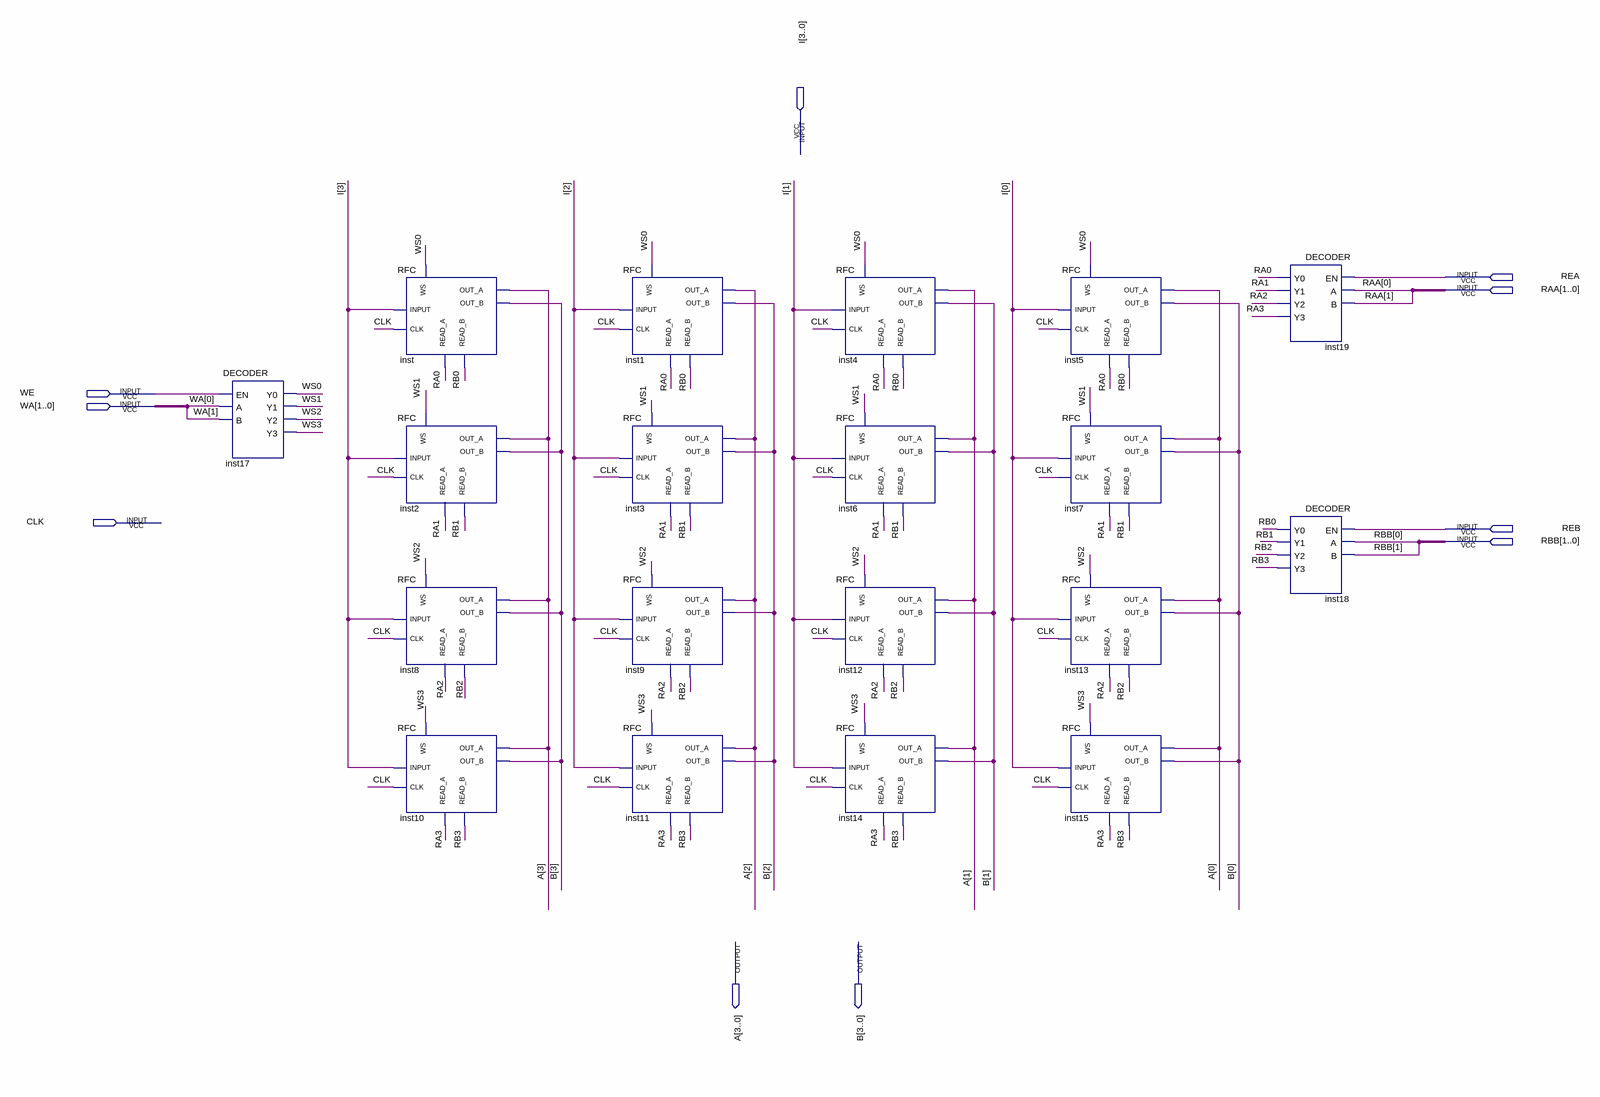
[diagram p0: schematic sheet]
// Quartus schematic RF.bdf as structural Verilog: 19 symbols, 10 pins
module RF (
  input  [3:0] I,
  input  REA,
  input  [1:0] RAA,
  input  WE,
  input  [1:0] WA,
  input  CLK,
  input  REB,
  input  [1:0] RBB,
  output [3:0] A,
  output [3:0] B
);

  wire RA0, RA1, RA2, RA3, RB0, RB1, RB2, RB3, WS0, WS1, WS2, WS3;

  DECODER inst17 (.EN(WE), .A(WA[0]), .B(WA[1]), .Y0(WS0), .Y1(WS1), .Y2(WS2), .Y3(WS3));
  RFC inst (.INPUT(I[3]), .WS(WS0), .CLK(CLK), .READ_A(RA0), .READ_B(RB0), .OUT_A(A[3]), .OUT_B(B[3]));
  RFC inst2 (.INPUT(I[3]), .WS(WS1), .CLK(CLK), .READ_A(RA1), .READ_B(RB1), .OUT_A(A[3]), .OUT_B(B[3]));
  RFC inst8 (.INPUT(I[3]), .WS(WS2), .CLK(CLK), .READ_A(RA2), .READ_B(RB2), .OUT_A(A[3]), .OUT_B(B[3]));
  RFC inst10 (.INPUT(I[3]), .WS(WS3), .CLK(CLK), .READ_A(RA3), .READ_B(RB3), .OUT_A(A[3]), .OUT_B(B[3]));
  RFC inst1 (.INPUT(I[2]), .WS(WS0), .CLK(CLK), .READ_A(RA0), .READ_B(RB0), .OUT_A(A[2]), .OUT_B(B[2]));
  RFC inst3 (.INPUT(I[2]), .WS(WS1), .CLK(CLK), .READ_A(RA1), .READ_B(RB1), .OUT_A(A[2]), .OUT_B(B[2]));
  RFC inst9 (.INPUT(I[2]), .WS(WS2), .CLK(CLK), .READ_A(RA2), .READ_B(RB2), .OUT_A(A[2]), .OUT_B(B[2]));
  RFC inst11 (.INPUT(I[2]), .WS(WS3), .CLK(CLK), .READ_A(RA3), .READ_B(RB3), .OUT_A(A[2]), .OUT_B(B[2]));
  RFC inst4 (.INPUT(I[1]), .WS(WS0), .CLK(CLK), .READ_A(RA0), .READ_B(RB0), .OUT_A(A[1]), .OUT_B(B[1]));
  RFC inst6 (.INPUT(I[1]), .WS(WS1), .CLK(CLK), .READ_A(RA1), .READ_B(RB1), .OUT_A(A[1]), .OUT_B(B[1]));
  RFC inst12 (.INPUT(I[1]), .WS(WS2), .CLK(CLK), .READ_A(RA2), .READ_B(RB2), .OUT_A(A[1]), .OUT_B(B[1]));
  RFC inst14 (.INPUT(I[1]), .WS(WS3), .CLK(CLK), .READ_A(RA3), .READ_B(RB3), .OUT_A(A[1]), .OUT_B(B[1]));
  RFC inst5 (.INPUT(I[0]), .WS(WS0), .CLK(CLK), .READ_A(RA0), .READ_B(RB0), .OUT_A(A[0]), .OUT_B(B[0]));
  RFC inst7 (.INPUT(I[0]), .WS(WS1), .CLK(CLK), .READ_A(RA1), .READ_B(RB1), .OUT_A(A[0]), .OUT_B(B[0]));
  RFC inst13 (.INPUT(I[0]), .WS(WS2), .CLK(CLK), .READ_A(RA2), .READ_B(RB2), .OUT_A(A[0]), .OUT_B(B[0]));
  RFC inst15 (.INPUT(I[0]), .WS(WS3), .CLK(CLK), .READ_A(RA3), .READ_B(RB3), .OUT_A(A[0]), .OUT_B(B[0]));
  DECODER inst19 (.EN(REA), .A(RAA[0]), .B(RAA[1]), .Y0(RA0), .Y1(RA1), .Y2(RA2), .Y3(RA3));
  DECODER inst18 (.EN(REB), .A(RBB[0]), .B(RBB[1]), .Y0(RB0), .Y1(RB1), .Y2(RB2), .Y3(RB3));
endmodule
